# Altium project ECG_Multi_Lead.PrjPcb (part 2 of 2)

## Sheet SCH_05_WCT_RLD.SchDoc
size A4; SheetNumber: 10; SheetTotal: 14; SPICEModelCacheSEOKWNHP: <root> / <DocumentId>SEOKWNHP</DocumentId> / </root>
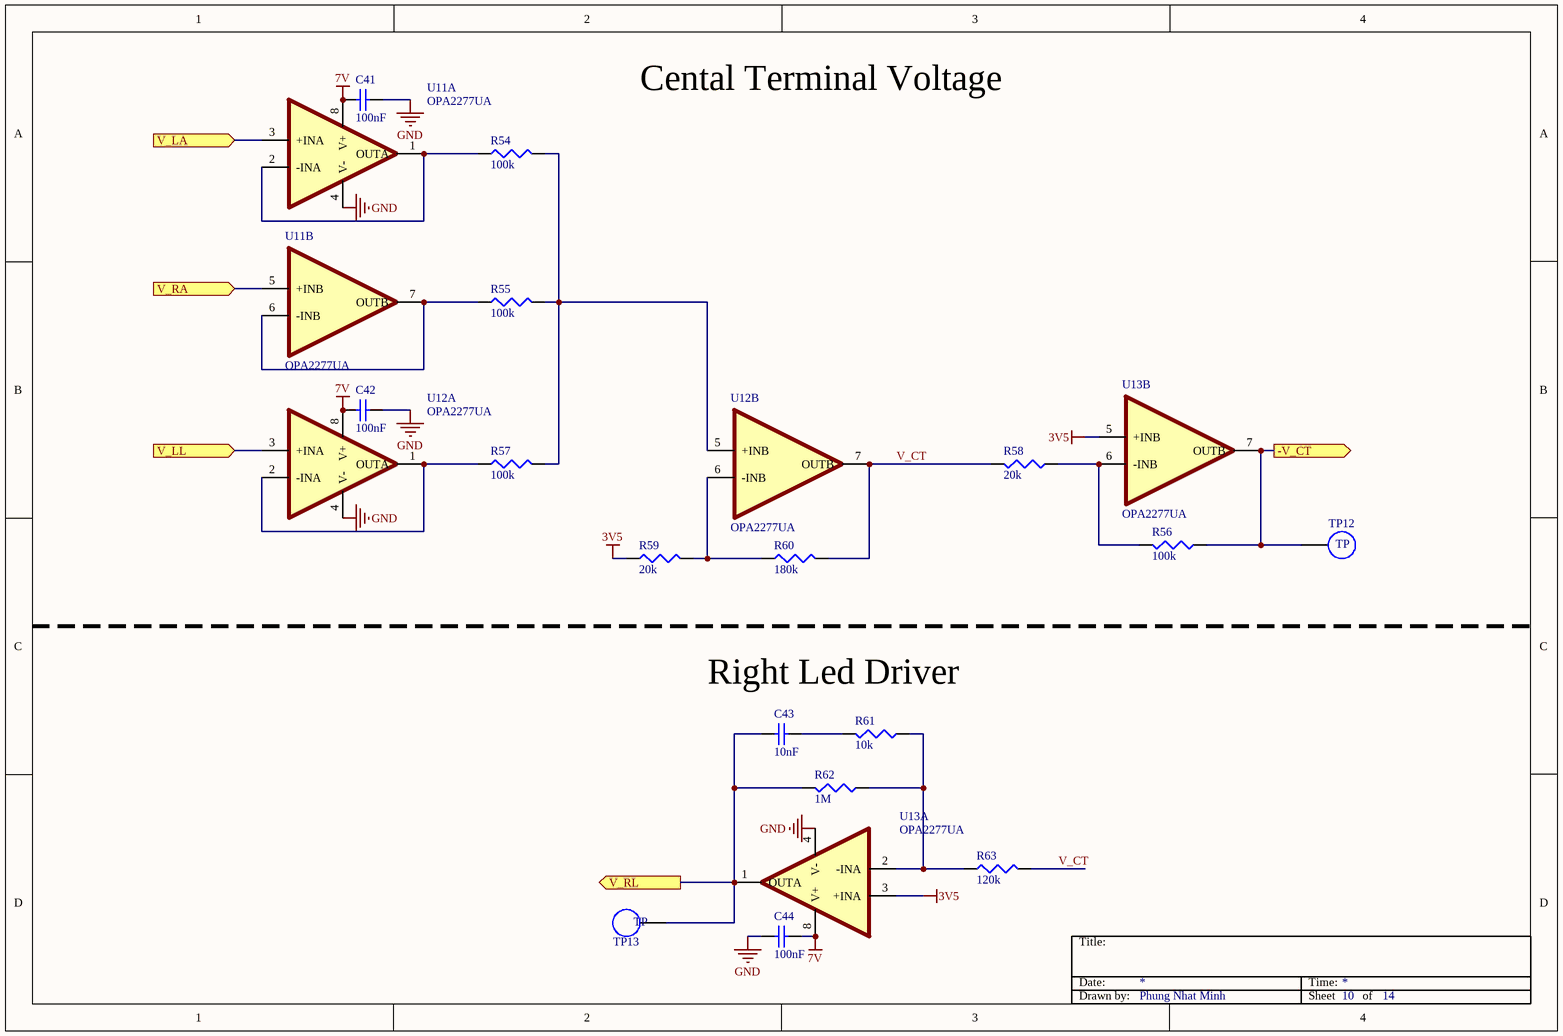
[diagram p10: SCH_05_WCT_RLD.SchDoc]

### Parts
C41  100nF  [WCAP-CSGP_0603_L1.6W0.8H0.8_Reflow]
C42  100nF  [WCAP-CSGP_0603_L1.6W0.8H0.8_Reflow]
C43  10nF  [WCAP-CSGP_0603_L1.6W0.8H0.8_Reflow]
C44  100nF  [WCAP-CSGP_0603_L1.6W0.8H0.8_Reflow]
R54  100k  [WRIS-PSMB_0603_L1.6W0.8H0.35]
R55  100k  [WRIS-PSMB_0603_L1.6W0.8H0.35]
R56  100k  [WRIS-PSMB_0603_L1.6W0.8H0.35]
R57  100k  [WRIS-PSMB_0603_L1.6W0.8H0.35]
R58  20k  [WRIS-PSMB_0603_L1.6W0.8H0.35]
R59  20k  [WRIS-PSMB_0603_L1.6W0.8H0.35]
R60  180k  [WRIS-PSMB_0603_L1.6W0.8H0.35]
R61  10k  [WRIS-PSMB_0603_L1.6W0.8H0.35]
R62  1M  [WRIS-PSMB_0603_L1.6W0.8H0.35]
R63  120k  [WRIS-PSMB_0603_L1.6W0.8H0.35]
TP12  Pad_Test_Point  [Pad_Test_Point]  (value not drawn)
TP13  Pad_Test_Point  [Pad_Test_Point]  (value not drawn)
U11  OPA2277UA  [SOIC127P599X175-8N]  (parts A,B of 2)
U12  OPA2277UA  [SOIC127P599X175-8N]  (parts A,B of 2)
U13  OPA2277UA  [SOIC127P599X175-8N]  (parts A,B of 2)

### Ports
-V_CT (out, see Schematic_Top[2B], SCH_06_Analog_Mux[2B]), V_LA (in, see Schematic_Top[1B], SCH_02_Electrodes[2A], SCH_03_Instrumentation_Amplifier[1A]), V_LL (in, see Schematic_Top[1B], SCH_02_Electrodes[2B], SCH_03_Instrumentation_Amplifier[1A]), V_RA (in, see Schematic_Top[1B], SCH_02_Electrodes[2A], SCH_03_Instrumentation_Amplifier[1A]), V_RL (out, see Schematic_Top[1B], SCH_02_Electrodes[2C])

### Nets
3V5: R59.1 U13.3(+INA) U13.5(+INB)
7V: C41.2 C42.2 C44.2 U11.8(V+) U12.8(V+) U13.8(V+)
GND: C41.1 C42.1 C44.1 U11.4(V-) U12.4(V-) U13.4(V-)
V_CT: R58.1 R60.2 R63.2 U12.7(OUTB)
V_LA: U11.3(+INA) ; port V_LA
V_LL: U12.3(+INA) ; port V_LL
V_RA: U11.5(+INB) ; port V_RA
NetC43_1: C43.1 R61.2
NetC43_2: C43.2 R62.2 TP13.1 U13.1(OUTA) ; port V_RL
NetR54_1: R54.1 U11.1(OUTA) U11.2(-INA)
NetR54_2: R54.2 R55.2 R57.2 U12.5(+INB)
NetR55_1: R55.1 U11.6(-INB) U11.7(OUTB)
NetR56_1: R56.1 R58.2 U13.6(-INB)
NetR56_2: R56.2 TP12.1 U13.7(OUTB) ; port -V_CT
NetR57_1: R57.1 U12.1(OUTA) U12.2(-INA)
NetR59_2: R59.2 R60.1 U12.6(-INB)
NetR61_1: R61.1 R62.1 R63.1 U13.2(-INA)

### Notes on the sheet
- Cental Terminal Voltage
- Right Led Driver
- Title:
- Date:
- Time:
- Drawn by:
- Phung Nhat Minh
- Sheet
- of
- (in symbol Pad_Test_Point) TP

### Library data of the parts
C41 C42 C44 = 885012206095: WCAP-CSGP Multilayer Ceramic Chip Capacitor, General Purpose, size 0603, X7R, 100nF, 50VDC; Manufacturer: Wurth Elektronik; Case/Size Code: 0603; Capacitance Tolerance: +/-10%; Dissipation Factor: 3%; Insulation Resistance: 5GOhm; Rated Voltage (DC): 50V; Technical Reference: X7R0603104K050DFCT10000; Manufacturer Part Number: 885012206095; Category: Multilayer Ceramic Chip Capacitors; Match Code: WCAP-CSGP; ComponentLink1Description: Website Link; ComponentLink1URL: https://www.we-online.com/redexpert/article/885012206095?ad; ComponentLink2Description: Datasheet Link; ComponentLink2URL: https://www.we-online.com/redexpert/spec/885012206095?ad; Mount: Surface Mount; Operating Temperature Max: 125°C; Operating Temperature Min: -55°C; Packaging: Tape and Reel; Length: 1.6mm; Width: 0.8mm; Height: 0.8mm; Capacitance: 100nF; Ceramic Type: X7R
C43 = 885012206089: WCAP-CSGP Multilayer Ceramic Chip Capacitor, General Purpose, size 0603, X7R, 10nF, 50VDC; Manufacturer: Wurth Elektronik; Case/Size Code: 0603; Capacitance Tolerance: +/-10%; Dissipation Factor: 2.5%; Insulation Resistance: 10GOhm; Rated Voltage (DC): 50V; Technical Reference: X7R0603103K050DFCT10000; Manufacturer Part Number: 885012206089; Category: Multilayer Ceramic Chip Capacitors; Match Code: WCAP-CSGP; ComponentLink1Description: Website Link; ComponentLink1URL: https://www.we-online.com/redexpert/article/885012206089?ad; ComponentLink2Description: Datasheet Link; ComponentLink2URL: https://www.we-online.com/redexpert/spec/885012206089?ad; Mount: Surface Mount; Operating Temperature Max: 125°C; Operating Temperature Min: -55°C; Packaging: Tape and Reel; Length: 1.6mm; Width: 0.8mm; Height: 0.8mm; Capacitance: 10nF; Ceramic Type: X7R
R54-R63 = 580060716001: WRIS-PSMB Metal Plate Resistor, SMT, size 0603, 0.33W, 5mΩ, +/-1%; Manufacturer: Wurth Elektronik; Case/Size Code: 0603; Rated Current: 8.12A; Technical Reference: MB0603R005F103KAATP0000; Temperature Coefficient of Resistance: +/-100ppm/°C; Manufacturer Part Number: 580060716001; Category: Metal Plate Resistors; Match Code: WRIS-PSMB; ComponentLink1Description: Website Link; ComponentLink1URL: https://www.we-online.com/redexpert/article/580060716001?ad; ComponentLink2Description: Datasheet Link; ComponentLink2URL: https://www.we-online.com/redexpert/spec/580060716001?ad; Mount: Surface Mount; Operating Temperature Max: 155°C; Operating Temperature Min: -55°C; Packaging: Tape and Reel; Length: 1.6mm; Width: 0.8mm; Height: 0.35mm; Rated Power: 0.33W; Resistance: 5mΩ; Resistance Tolerance: +/-1%
U11-U13 = OPA2277UA: MP: OPA2227UA; Package: None; Price: None; Value: *; Availability: Unavailable

## Sheet SCH_07_Filter.SchDoc
size A4; SheetNumber: 12; SheetTotal: 14; SPICEModelCacheEHPMWYPG: <root> / <DocumentId>EHPMWYPG</DocumentId> / <CacheFrame Number="0"> / <Model Name="0603_885012206095_100nf" Kind="CKT"> / <Text>******* / .subckt 0603_885012206095_100nF 1 2 / Rser 1 3 0.0157659152881 / Lser 2 4 3.10171966E-10 / C1 3 4 0.0000001 / Rpar 3 4 5000000000 / .ends 0603_885012206095_100nF</Text> / </Model> / <Model Name="0603_885012106031_10uf" Kind="CKT"> / <Text>******* / .subckt 0603_885012106031_10uF 1 2 / Rser 1 3 0.0105 / Lser 2 4 0.0000000008 / C1 3 4 0.00001 / Rpar 3 4 10000000 / .ends 0603_885012106031_10uF</Text> / </Model> / <Model Name="0603_885012106022_1uf" Kind="CKT"> / <Text>******* / .subckt 0603_885012106022_1uF 1 2 / Rser 1 3 0.00857861035867 / Lser 2 4 3.03497279E-10 / C1 3 4 0.000001 / Rpar 3 4 500000000 / .ends 0603_885012106022_1uF</Text> / </Model> / <Model Name="0603_885012206046_100nf" Kind="CKT"> / <Text>******* / .subckt 0603_885012206046_100nF 1 2 / Rser 1 3 0.0189313024822 / Lser 2 4 4.50736859E-10 / C1 3 4 0.0000001 / Rpar 3 4 5000000000 / .ends 0603_885012206046_100nF</Text> / </Model> / </CacheFrame> / </root>
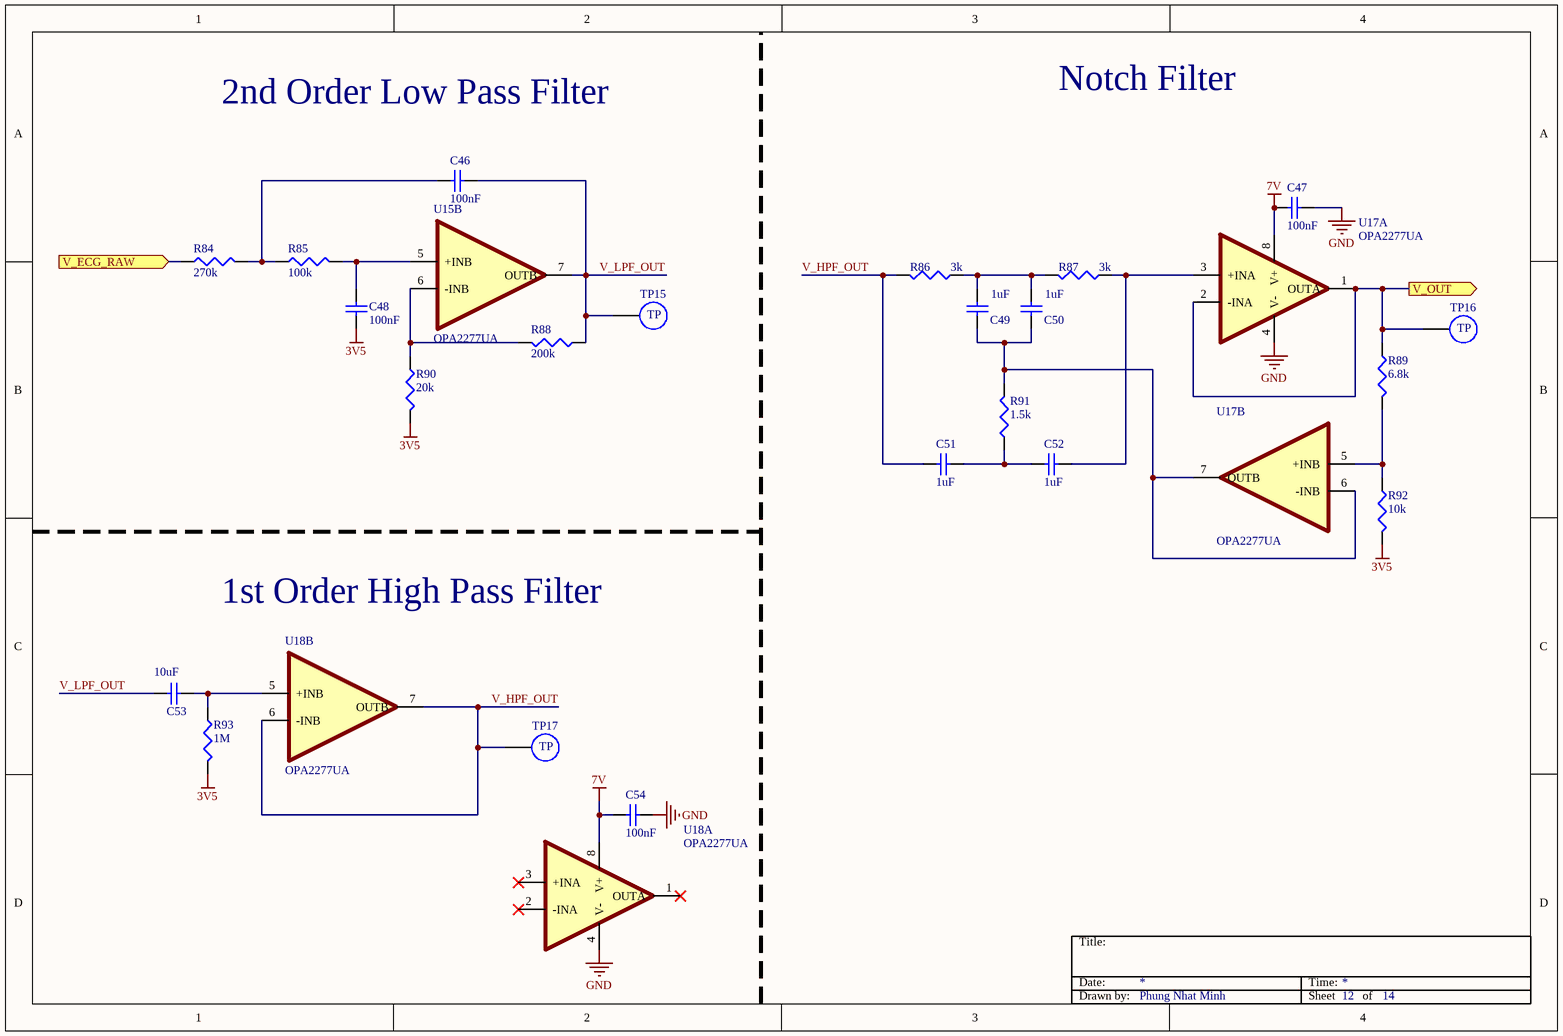
[diagram p11: SCH_07_Filter.SchDoc]

### Parts
C46  100nF  [WCAP-CSGP_0603_L1.6W0.8H0.8_Reflow]
C47  100nF  [WCAP-CSGP_0603_L1.6W0.8H0.8_Reflow]
C48  100nF  [WCAP-CSGP_0603_L1.6W0.8H0.8_Reflow]
C49  1uF  [WCAP-CSGP_0603_L1.6W0.8H0.8_Reflow]
C50  1uF  [WCAP-CSGP_0603_L1.6W0.8H0.8_Reflow]
C51  1uF  [WCAP-CSGP_0603_L1.6W0.8H0.8_Reflow]
C52  1uF  [WCAP-CSGP_0603_L1.6W0.8H0.8_Reflow]
C53  10uF  [WCAP-CSGP_0603_L1.6W0.8H0.8_Reflow]
C54  100nF  [WCAP-CSGP_0603_L1.6W0.8H0.8_Reflow]
R84  270k  [WRIS-PSMB_0603_L1.6W0.8H0.35]
R85  100k  [WRIS-PSMB_0603_L1.6W0.8H0.35]
R86  3k  [WRIS-PSMB_0603_L1.6W0.8H0.35]
R87  3k  [WRIS-PSMB_0603_L1.6W0.8H0.35]
R88  200k  [WRIS-PSMB_0603_L1.6W0.8H0.35]
R89  6.8k  [WRIS-PSMB_0603_L1.6W0.8H0.35]
R90  20k  [WRIS-PSMB_0603_L1.6W0.8H0.35]
R91  1.5k  [WRIS-PSMB_0603_L1.6W0.8H0.35]
R92  10k  [WRIS-PSMB_0603_L1.6W0.8H0.35]
R93  1M  [WRIS-PSMB_0603_L1.6W0.8H0.35]
TP15  Pad_Test_Point  [Pad_Test_Point]  (value not drawn)
TP16  Pad_Test_Point  [Pad_Test_Point]  (value not drawn)
TP17  Pad_Test_Point  [Pad_Test_Point]  (value not drawn)
U15  OPA2277UA  [SOIC127P599X175-8N]  (part B of 2)
U17  OPA2277UA  [SOIC127P599X175-8N]  (parts A,B of 2)
U18  OPA2277UA  [SOIC127P599X175-8N]  (parts A,B of 2)

### Ports
V_ECG_RAW (in, see Schematic_Top[3A], SCH_06_Analog_Mux[4B]), V_OUT (out, see Schematic_Top[3B], SCH_08_ADC[2B])

### Nets
3V5: C48.1 R90.2 R92.2 R93.2
7V: C47.2 C54.2 U17.8(V+) U18.8(V+)
GND: C47.1 C54.1 U17.4(V-) U18.4(V-)
V_HPF_OUT: C51.2 R86.2 TP17.1 U18.6(-INB) U18.7(OUTB)
V_LPF_OUT: C46.1 C53.1 R88.1 TP15.1 U15.7(OUTB)
NetC46_2: C46.2 R84.2 R85.1
NetC48_2: C48.2 R85.2 U15.5(+INB)
NetC49_1: C49.1 C50.1 R91.2 U17.6(-INB) U17.7(OUTB)
NetC49_2: C49.2 C50.2 R86.1 R87.2
NetC51_1: C51.1 C52.2 R91.1
NetC52_1: C52.1 R87.1 U17.3(+INA)
NetC53_2: C53.2 R93.1 U18.5(+INB)
NetR74_2: R84.1 ; port V_ECG_RAW
NetR88_2: R88.2 R90.1 U15.6(-INB)
NetR89_1: R89.1 TP16.1 U17.1(OUTA) U17.2(-INA) ; port V_OUT
NetR89_2: R89.2 R92.1 U17.5(+INB)

Not connected (* = marked no-connect by the designer): U18 1(OUTA)* 2(-INA)* 3(+INA)*

### Notes on the sheet
- 2nd Order Low Pass Filter
- Notch Filter
- 1st Order High Pass Filter
- Title:
- Date:
- Time:
- Drawn by:
- Phung Nhat Minh
- Sheet
- of
- (in symbol Pad_Test_Point) TP

### Library data of the parts
C46 C48 C54 = 885012206095: as C41 on sheet SCH_05_WCT_RLD; Manufacturer Part Number: 885012206095; Category: Multilayer Ceramic Chip Capacitors; Match Code: WCAP-CSGP; ComponentLink1Description: Website Link; ComponentLink1URL: https://www.we-online.com/redexpert/article/885012206095?ad; ComponentLink2Description: Datasheet Link; ComponentLink2URL: https://www.we-online.com/redexpert/spec/885012206095?ad; Mount: Surface Mount; Operating Temperature Max: 125°C; Operating Temperature Min: -55°C; Packaging: Tape and Reel; Length: 1.6mm; Width: 0.8mm; Height: 0.8mm; Capacitance: 100nF; Ceramic Type: X7R
C47 = 885012206046: WCAP-CSGP Multilayer Ceramic Chip Capacitor, General Purpose, size 0603, X7R, 100nF, 16VDC; Manufacturer: Wurth Elektronik; Case/Size Code: 0603; Capacitance Tolerance: +/-10%; Dissipation Factor: 3.5%; Insulation Resistance: 5GOhm; Rated Voltage (DC): 16V; Technical Reference: X7R0603104K016DFCT10000; Manufacturer Part Number: 885012206046; Category: Multilayer Ceramic Chip Capacitors; Match Code: WCAP-CSGP; ComponentLink1Description: Website Link; ComponentLink1URL: https://www.we-online.com/redexpert/article/885012206046?ad; ComponentLink2Description: Datasheet Link; ComponentLink2URL: https://www.we-online.com/redexpert/spec/885012206046?ad; Mount: Surface Mount; Operating Temperature Max: 125°C; Operating Temperature Min: -55°C; Packaging: Tape and Reel; Length: 1.6mm; Width: 0.8mm; Height: 0.8mm; Capacitance: 100nF; Ceramic Type: X7R
C49-C52 = 885012106022: WCAP-CSGP Multilayer Ceramic Chip Capacitor, General Purpose, size 0603, X5R, 1uF, 25VDC; Manufacturer: Wurth Elektronik; Case/Size Code: 0603; Capacitance Tolerance: +/-20%; Dissipation Factor: 10%; Insulation Resistance: 0.5GOhm; Rated Voltage (DC): 25V; Technical Reference: X5R0603105M025DFCT10000; Manufacturer Part Number: 885012106022; Category: Multilayer Ceramic Chip Capacitors; Match Code: WCAP-CSGP; ComponentLink1Description: Website Link; ComponentLink1URL: https://www.we-online.com/redexpert/article/885012106022?ad; ComponentLink2Description: Datasheet Link; ComponentLink2URL: https://www.we-online.com/redexpert/spec/885012106022?ad; Mount: Surface Mount; Operating Temperature Max: 85°C; Operating Temperature Min: -55°C; Packaging: Tape and Reel; Length: 1.6mm; Width: 0.8mm; Height: 0.8mm; Capacitance: 1uF; Ceramic Type: X5R
C53 = 885012106031: WCAP-CSGP Multilayer Ceramic Chip Capacitor, General Purpose, size 0603, X5R, 10uF, 25VDC; Manufacturer: Wurth Elektronik; Case/Size Code: 0603; Capacitance Tolerance: +/20%; Dissipation Factor: 20%; Insulation Resistance: 0.01GOhm; Rated Voltage (DC): 25V; Technical Reference: X5R0603106M025DFCT10000; Manufacturer Part Number: 885012106031; Category: Multilayer Ceramic Chip Capacitors; Match Code: WCAP-CSGP; ComponentLink1Description: Website Link; ComponentLink1URL: https://www.we-online.com/redexpert/article/885012106031?ad; ComponentLink2Description: Datasheet Link; ComponentLink2URL: https://www.we-online.com/redexpert/spec/885012106031?ad; Mount: Surface Mount; Operating Temperature Max: 85°C; Operating Temperature Min: -55°C; Packaging: Tape and Reel; Length: 1.6mm; Width: 0.8mm; Height: 0.8mm; Capacitance: 10uF; Ceramic Type: X5R
R84-R93 = 580060716001: as R54 on sheet SCH_05_WCT_RLD; Manufacturer Part Number: 580060716001; Category: Metal Plate Resistors; Match Code: WRIS-PSMB; ComponentLink1Description: Website Link; ComponentLink1URL: https://www.we-online.com/redexpert/article/580060716001?ad; ComponentLink2Description: Datasheet Link; ComponentLink2URL: https://www.we-online.com/redexpert/spec/580060716001?ad; Mount: Surface Mount; Operating Temperature Max: 155°C; Operating Temperature Min: -55°C; Packaging: Tape and Reel; Length: 1.6mm; Width: 0.8mm; Height: 0.35mm; Rated Power: 0.33W; Resistance: 5mΩ; Resistance Tolerance: +/-1%
U15 U17 U18 = OPA2277UA: MP: OPA2227UA; Package: None; Price: None; Value: *; Availability: Unavailable

## Sheet SCH_04_Chest_Lead_Amplifier.SchDoc
size A4; SheetNumber: 9; SheetTotal: 14; SPICEModelCacheUCDMULDR: <root> / <DocumentId>UCDMULDR</DocumentId> / <CacheFrame Number="0"> / <Model Name="0603_885012206095_100nf" Kind="CKT"> / <Text>******* / .subckt 0603_885012206095_100nF 1 2 / Rser 1 3 0.0157659152881 / Lser 2 4 3.10171966E-10 / C1 3 4 0.0000001 / Rpar 3 4 5000000000 / .ends 0603_885012206095_100nF</Text> / </Model> / </CacheFrame> / </root>
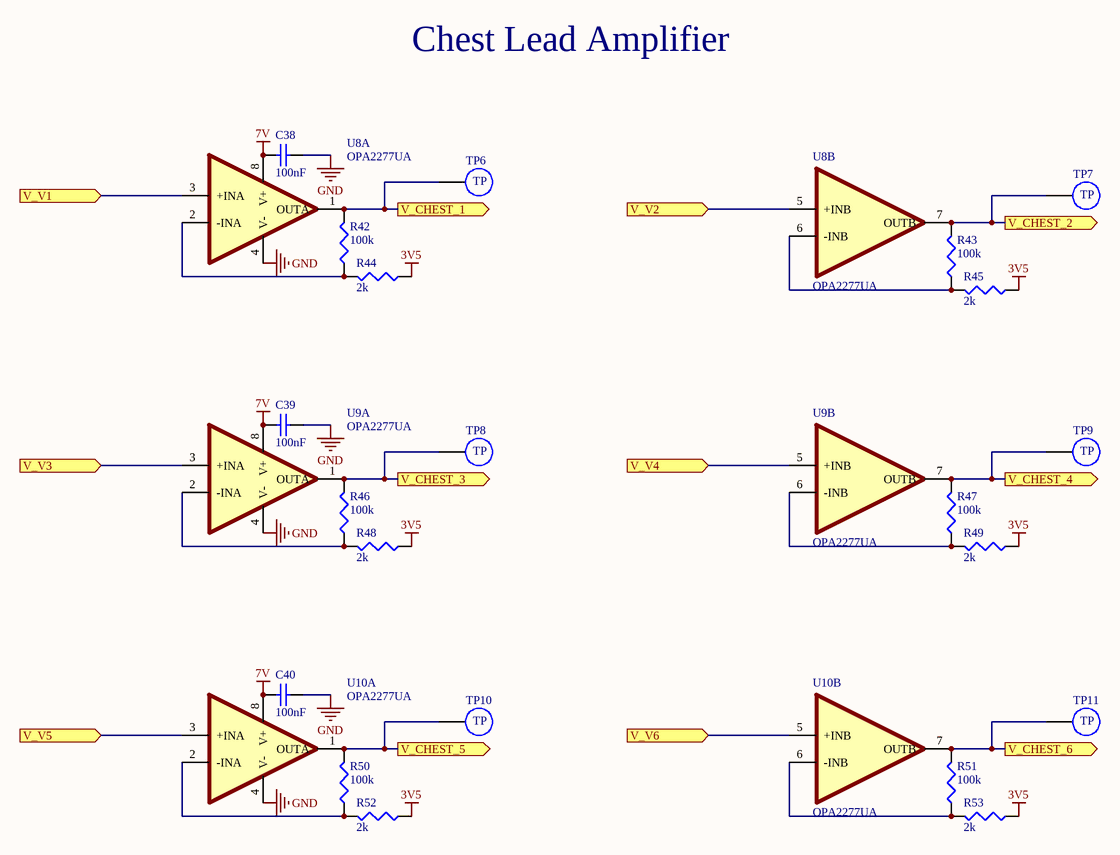
[diagram p12: SCH_04_Chest_Lead_Amplifier.SchDoc]

### Parts
C38  100nF  [WCAP-CSGP_0603_L1.6W0.8H0.8_Reflow]
C39  100nF  [WCAP-CSGP_0603_L1.6W0.8H0.8_Reflow]
C40  100nF  [WCAP-CSGP_0603_L1.6W0.8H0.8_Reflow]
R42  100k  [WRIS-PSMB_0603_L1.6W0.8H0.35]
R43  100k  [WRIS-PSMB_0603_L1.6W0.8H0.35]
R44  2k  [WRIS-PSMB_0603_L1.6W0.8H0.35]
R45  2k  [WRIS-PSMB_0603_L1.6W0.8H0.35]
R46  100k  [WRIS-PSMB_0603_L1.6W0.8H0.35]
R47  100k  [WRIS-PSMB_0603_L1.6W0.8H0.35]
R48  2k  [WRIS-PSMB_0603_L1.6W0.8H0.35]
R49  2k  [WRIS-PSMB_0603_L1.6W0.8H0.35]
R50  100k  [WRIS-PSMB_0603_L1.6W0.8H0.35]
R51  100k  [WRIS-PSMB_0603_L1.6W0.8H0.35]
R52  2k  [WRIS-PSMB_0603_L1.6W0.8H0.35]
R53  2k  [WRIS-PSMB_0603_L1.6W0.8H0.35]
TP6  Pad_Test_Point  [Pad_Test_Point]  (value not drawn)
TP7  Pad_Test_Point  [Pad_Test_Point]  (value not drawn)
TP8  Pad_Test_Point  [Pad_Test_Point]  (value not drawn)
TP9  Pad_Test_Point  [Pad_Test_Point]  (value not drawn)
TP10  Pad_Test_Point  [Pad_Test_Point]  (value not drawn)
TP11  Pad_Test_Point  [Pad_Test_Point]  (value not drawn)
U8  OPA2277UA  [SOIC127P599X175-8N]  (parts A,B of 2)
U9  OPA2277UA  [SOIC127P599X175-8N]  (parts A,B of 2)
U10  OPA2277UA  [SOIC127P599X175-8N]  (parts A,B of 2)

### Ports
V_CHEST_1 (out, see Schematic_Top[2C], SCH_06_Analog_Mux[2C]), V_CHEST_2 (out, see Schematic_Top[2C], SCH_06_Analog_Mux[2C]), V_CHEST_3 (out, see Schematic_Top[2C], SCH_06_Analog_Mux[2C]), V_CHEST_4 (out, see Schematic_Top[2C], SCH_06_Analog_Mux[2C]), V_CHEST_5 (out, see Schematic_Top[2C], SCH_06_Analog_Mux[2C]), V_CHEST_6 (out, see Schematic_Top[2C], SCH_06_Analog_Mux[2D]), V_V1 (in, see Schematic_Top[1C], SCH_02_Electrodes[4A]), V_V2 (in, see Schematic_Top[1C], SCH_02_Electrodes[4A]), V_V3 (in, see Schematic_Top[1C], SCH_02_Electrodes[4B]), V_V4 (in, see Schematic_Top[1C], SCH_02_Electrodes[4C]), V_V5 (in, see Schematic_Top[1C], SCH_02_Electrodes[4C]), V_V6 (in, see Schematic_Top[1C], SCH_02_Electrodes[4D])

### Nets
3V5: R44.1 R45.1 R48.1 R49.1 R52.1 R53.1
7V: C38.2 C39.2 C40.2 U8.8(V+) U9.8(V+) U10.8(V+)
GND: C38.1 C39.1 C40.1 U8.4(V-) U9.4(V-) U10.4(V-)
NetC14_2: U8.3(+INA) ; port V_V1
NetC18_2: U8.5(+INB) ; port V_V2
NetC22_2: U9.3(+INA) ; port V_V3
NetC25_2: U9.5(+INB) ; port V_V4
NetC27_2: U10.3(+INA) ; port V_V5
NetC29_2: U10.5(+INB) ; port V_V6
NetR42_1: R42.1 R44.2 U8.2(-INA)
NetR42_2: R42.2 TP6.1 U8.1(OUTA) ; port V_CHEST_1
NetR43_1: R43.1 R45.2 U8.6(-INB)
NetR43_2: R43.2 TP7.1 U8.7(OUTB) ; port V_CHEST_2
NetR46_1: R46.1 R48.2 U9.2(-INA)
NetR46_2: R46.2 TP8.1 U9.1(OUTA) ; port V_CHEST_3
NetR47_1: R47.1 R49.2 U9.6(-INB)
NetR47_2: R47.2 TP9.1 U9.7(OUTB) ; port V_CHEST_4
NetR50_1: R50.1 R52.2 U10.2(-INA)
NetR50_2: R50.2 TP10.1 U10.1(OUTA) ; port V_CHEST_5
NetR51_1: R51.1 R53.2 U10.6(-INB)
NetR51_2: R51.2 TP11.1 U10.7(OUTB) ; port V_CHEST_6

### Notes on the sheet
- Chest Lead Amplifier
- Title:
- Date:
- Time:
- Drawn by:
- Phung Nhat Minh
- Sheet
- of
- (in symbol Pad_Test_Point) TP

### Library data of the parts
C38-C40 = 885012206095: as C41 on sheet SCH_05_WCT_RLD; Manufacturer Part Number: 885012206095; Category: Multilayer Ceramic Chip Capacitors; Match Code: WCAP-CSGP; ComponentLink1Description: Website Link; ComponentLink1URL: https://www.we-online.com/redexpert/article/885012206095?ad; ComponentLink2Description: Datasheet Link; ComponentLink2URL: https://www.we-online.com/redexpert/spec/885012206095?ad; Mount: Surface Mount; Operating Temperature Max: 125°C; Operating Temperature Min: -55°C; Packaging: Tape and Reel; Length: 1.6mm; Width: 0.8mm; Height: 0.8mm; Capacitance: 100nF; Ceramic Type: X7R
R42-R53 = 580060716001: as R54 on sheet SCH_05_WCT_RLD; Manufacturer Part Number: 580060716001; Category: Metal Plate Resistors; Match Code: WRIS-PSMB; ComponentLink1Description: Website Link; ComponentLink1URL: https://www.we-online.com/redexpert/article/580060716001?ad; ComponentLink2Description: Datasheet Link; ComponentLink2URL: https://www.we-online.com/redexpert/spec/580060716001?ad; Mount: Surface Mount; Operating Temperature Max: 155°C; Operating Temperature Min: -55°C; Packaging: Tape and Reel; Length: 1.6mm; Width: 0.8mm; Height: 0.35mm; Rated Power: 0.33W; Resistance: 5mΩ; Resistance Tolerance: +/-1%
U8-U10 = OPA2277UA: MP: OPA2227UA; Package: None; Price: None; Value: *; Availability: Unavailable

## Sheet Block_Diagram_02.SchDoc
size A4; SheetNumber: 3; SheetTotal: 14
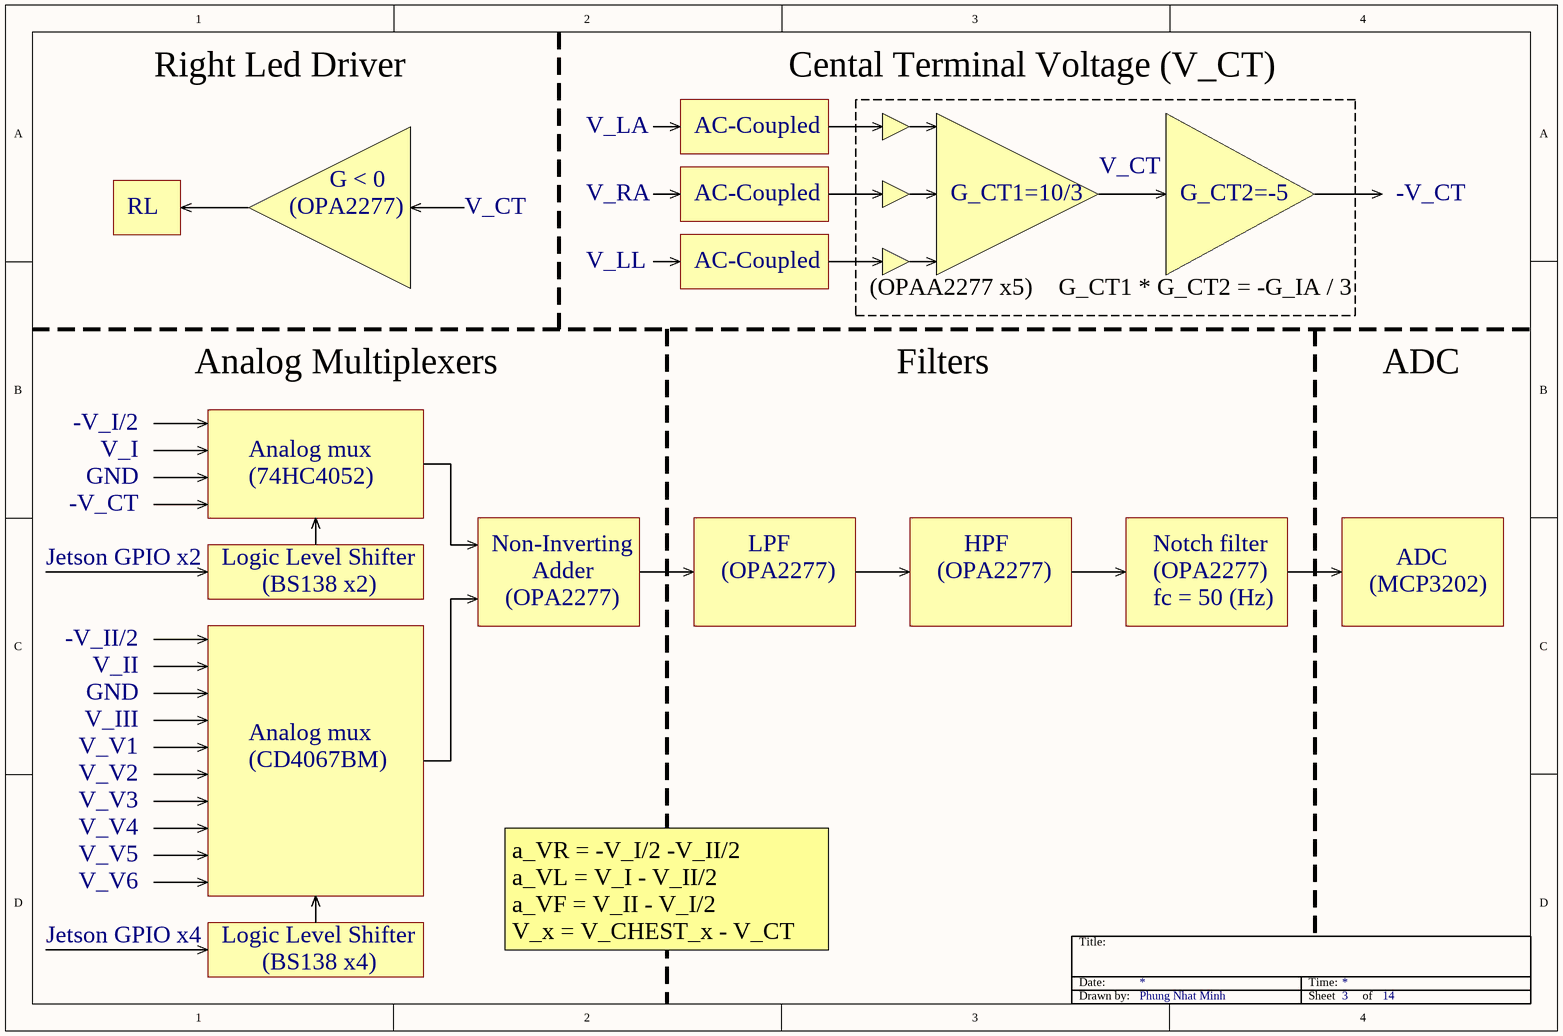
[diagram p13: Block_Diagram_02.SchDoc]

### Notes on the sheet
- Right Led Driver
- Cental Terminal Voltage (V_CT)
- V_LA
- AC-Coupled
- V_CT
- RL
- (OPA2277)
- G < 0
- V_RA
- G_CT1=10/3
- G_CT2=-5
- -V_CT
- V_LL
- (OPAA2277 x5)
- G_CT1 * G_CT2 = -G_IA / 3
- Analog Multiplexers
- Filters
- ADC
- -V_I/2
- V_I
- GND
- Analog mux
- (74HC4052)
- Jetson GPIO x2
- Logic Level Shifter
- Non-Inverting
- Adder
- LPF
- HPF
- Notch filter
- -V_II/2
- (BS138 x2)
- fc = 50 (Hz)
- (MCP3202)
- V_II
- V_III
- V_V1
- V_V2
- (CD4067BM)
- V_V3
- V_V4
- V_V5
- V_V6
- Jetson GPIO x4
- (BS138 x4)
- a_VR = -V_I/2 -V_II/2
  a_VL = V_I - V_II/2
  a_VF = V_II - V_I/2
  V_x = V_CHEST_x - V_CT
- Title:
- Date:
- Time:
- Drawn by:
- Phung Nhat Minh
- Sheet
- of

## Nets that join several sheets
3V3: SCH_08_ADC (C55.2 C56.2 U19.8), SCH_01_Power (C8.2 R6.2 U3.2 U3.4), SCH_06_Analog_Mux (16 pins)
3V5: SCH_03_Instrumentation_Amplifier (5 pins), SCH_01_Power (5 pins), SCH_06_Analog_Mux (R76.1 U14.15 U16.7), SCH_05_WCT_RLD (R59.1 U13.3 U13.5), SCH_07_Filter (C48.1 R90.2 R92.2 R93.2), SCH_04_Chest_Lead_Amplifier (6 pins)
7V: SCH_03_Instrumentation_Amplifier (8 pins), SCH_01_Power (11 pins), SCH_06_Analog_Mux (12 pins), SCH_02_Electrodes (19 pins), SCH_05_WCT_RLD (6 pins), SCH_07_Filter (C47.2 C54.2 U17.8 U18.8), SCH_04_Chest_Lead_Amplifier (6 pins)
GND: SCH_03_Instrumentation_Amplifier (8 pins), SCH_08_ADC (C55.1 C56.1 U19.3 U19.4), SCH_01_Power (22 pins), SCH_06_Analog_Mux (5 pins), SCH_09_InOut_Terminal (5 pins), SCH_02_Electrodes (28 pins), SCH_05_WCT_RLD (6 pins), SCH_07_Filter (C47.1 C54.1 U17.4 U18.4), SCH_04_Chest_Lead_Amplifier (6 pins)
-V_I / 2: SCH_03_Instrumentation_Amplifier (R38.1 TP1.1 U4.6), SCH_06_Analog_Mux (U14.12)
-V_II / 2: SCH_03_Instrumentation_Amplifier (R40.1 TP2.1 U5.6), SCH_06_Analog_Mux (U16.9)
NetC14_2: SCH_02_Electrodes (C14.2 R10.1 R12.2), SCH_04_Chest_Lead_Amplifier (U8.3)
NetC18_2: SCH_02_Electrodes (C18.2 R16.1 R18.2), SCH_04_Chest_Lead_Amplifier (U8.5)
NetC22_2: SCH_02_Electrodes (C22.2 R22.1 R24.2), SCH_04_Chest_Lead_Amplifier (U9.3)
NetC25_2: SCH_02_Electrodes (C25.2 R27.1 R28.2), SCH_04_Chest_Lead_Amplifier (U9.5)
NetC27_2: SCH_02_Electrodes (C27.2 R30.1 R31.2), SCH_04_Chest_Lead_Amplifier (U10.3)
NetC29_2: SCH_02_Electrodes (C29.2 R33.1 R34.2), SCH_04_Chest_Lead_Amplifier (U10.5)
NetC43_2: SCH_02_Electrodes (D15.3 R26.1), SCH_05_WCT_RLD (C43.2 R62.2 TP13.1 U13.1)
NetJ5_19: SCH_08_ADC (U19.5), SCH_09_InOut_Terminal (J5.19)
NetJ5_21: SCH_08_ADC (U19.6), SCH_09_InOut_Terminal (J5.21)
NetJ5_23: SCH_08_ADC (U19.7), SCH_09_InOut_Terminal (J5.23)
NetJ5_26: SCH_08_ADC (U19.1), SCH_09_InOut_Terminal (J5.26)
NetJ5_29: SCH_06_Analog_Mux (Q8.2 R83.1), SCH_09_InOut_Terminal (J5.29)
NetJ5_31: SCH_06_Analog_Mux (Q7.2 R81.1), SCH_09_InOut_Terminal (J5.31)
NetJ5_33: SCH_06_Analog_Mux (Q6.2 R78.1), SCH_09_InOut_Terminal (J5.33)
NetJ5_35: SCH_06_Analog_Mux (Q5.2 R75.1), SCH_09_InOut_Terminal (J5.35)
NetJ5_36: SCH_06_Analog_Mux (Q3.2 R70.1), SCH_09_InOut_Terminal (J5.36)
NetJ5_37: SCH_06_Analog_Mux (Q4.2 R72.1), SCH_09_InOut_Terminal (J5.37)
NetJ5_38: SCH_06_Analog_Mux (Q2.2 R68.1), SCH_09_InOut_Terminal (J5.38)
NetJ5_40: SCH_06_Analog_Mux (Q1.2 R65.1), SCH_09_InOut_Terminal (J5.40)
NetR39_2: SCH_03_Instrumentation_Amplifier (R39.2 TP3.1 U6.1), SCH_06_Analog_Mux (U14.14)
NetR41_2: SCH_03_Instrumentation_Amplifier (R41.2 TP5.1 U6.7), SCH_06_Analog_Mux (U16.8)
NetR42_2: SCH_06_Analog_Mux (U16.5), SCH_04_Chest_Lead_Amplifier (R42.2 TP6.1 U8.1)
NetR43_2: SCH_06_Analog_Mux (U16.4), SCH_04_Chest_Lead_Amplifier (R43.2 TP7.1 U8.7)
NetR46_2: SCH_06_Analog_Mux (U16.3), SCH_04_Chest_Lead_Amplifier (R46.2 TP8.1 U9.1)
NetR47_2: SCH_06_Analog_Mux (U16.2), SCH_04_Chest_Lead_Amplifier (R47.2 TP9.1 U9.7)
NetR50_2: SCH_06_Analog_Mux (U16.23), SCH_04_Chest_Lead_Amplifier (R50.2 TP10.1 U10.1)
NetR51_2: SCH_06_Analog_Mux (U16.22), SCH_04_Chest_Lead_Amplifier (R51.2 TP11.1 U10.7)
NetR56_2: SCH_06_Analog_Mux (U14.11), SCH_05_WCT_RLD (R56.2 TP12.1 U13.7)
NetR74_2: SCH_06_Analog_Mux (R74.2 TP14.1 U15.1), SCH_07_Filter (R84.1)
NetR89_1: SCH_08_ADC (U19.2), SCH_07_Filter (R89.1 TP16.1 U17.1 U17.2)
NetTP4_1: SCH_03_Instrumentation_Amplifier (TP4.1 U7.6), SCH_06_Analog_Mux (U16.6)
V_JET_5V: SCH_01_Power (D2.1 R3.2), SCH_09_InOut_Terminal (J5.2 J5.4)
V_LA: SCH_03_Instrumentation_Amplifier (C33.1 C37.1 U4.2 U7.2), SCH_02_Electrodes (C13.2 R9.1 R11.2), SCH_05_WCT_RLD (U11.3)
V_LL: SCH_03_Instrumentation_Amplifier (C34.1 C37.2 U5.2 U7.3), SCH_02_Electrodes (C21.2 R21.1 R23.2), SCH_05_WCT_RLD (U12.3)
V_RA: SCH_03_Instrumentation_Amplifier (C33.2 C34.2 U4.3 U5.3), SCH_02_Electrodes (C17.2 R15.1 R17.2), SCH_05_WCT_RLD (U11.5)